# Altium schematic sheet Sheet3_mk.SchDoc
size 420 x 297 mm; Address1: Address1; Address2: Address2; Address3: Address3; Address4: Address4; SheetNumber: 1; Scale: 1:1; Обозначение документа: АБВГ.123456.001 Э3
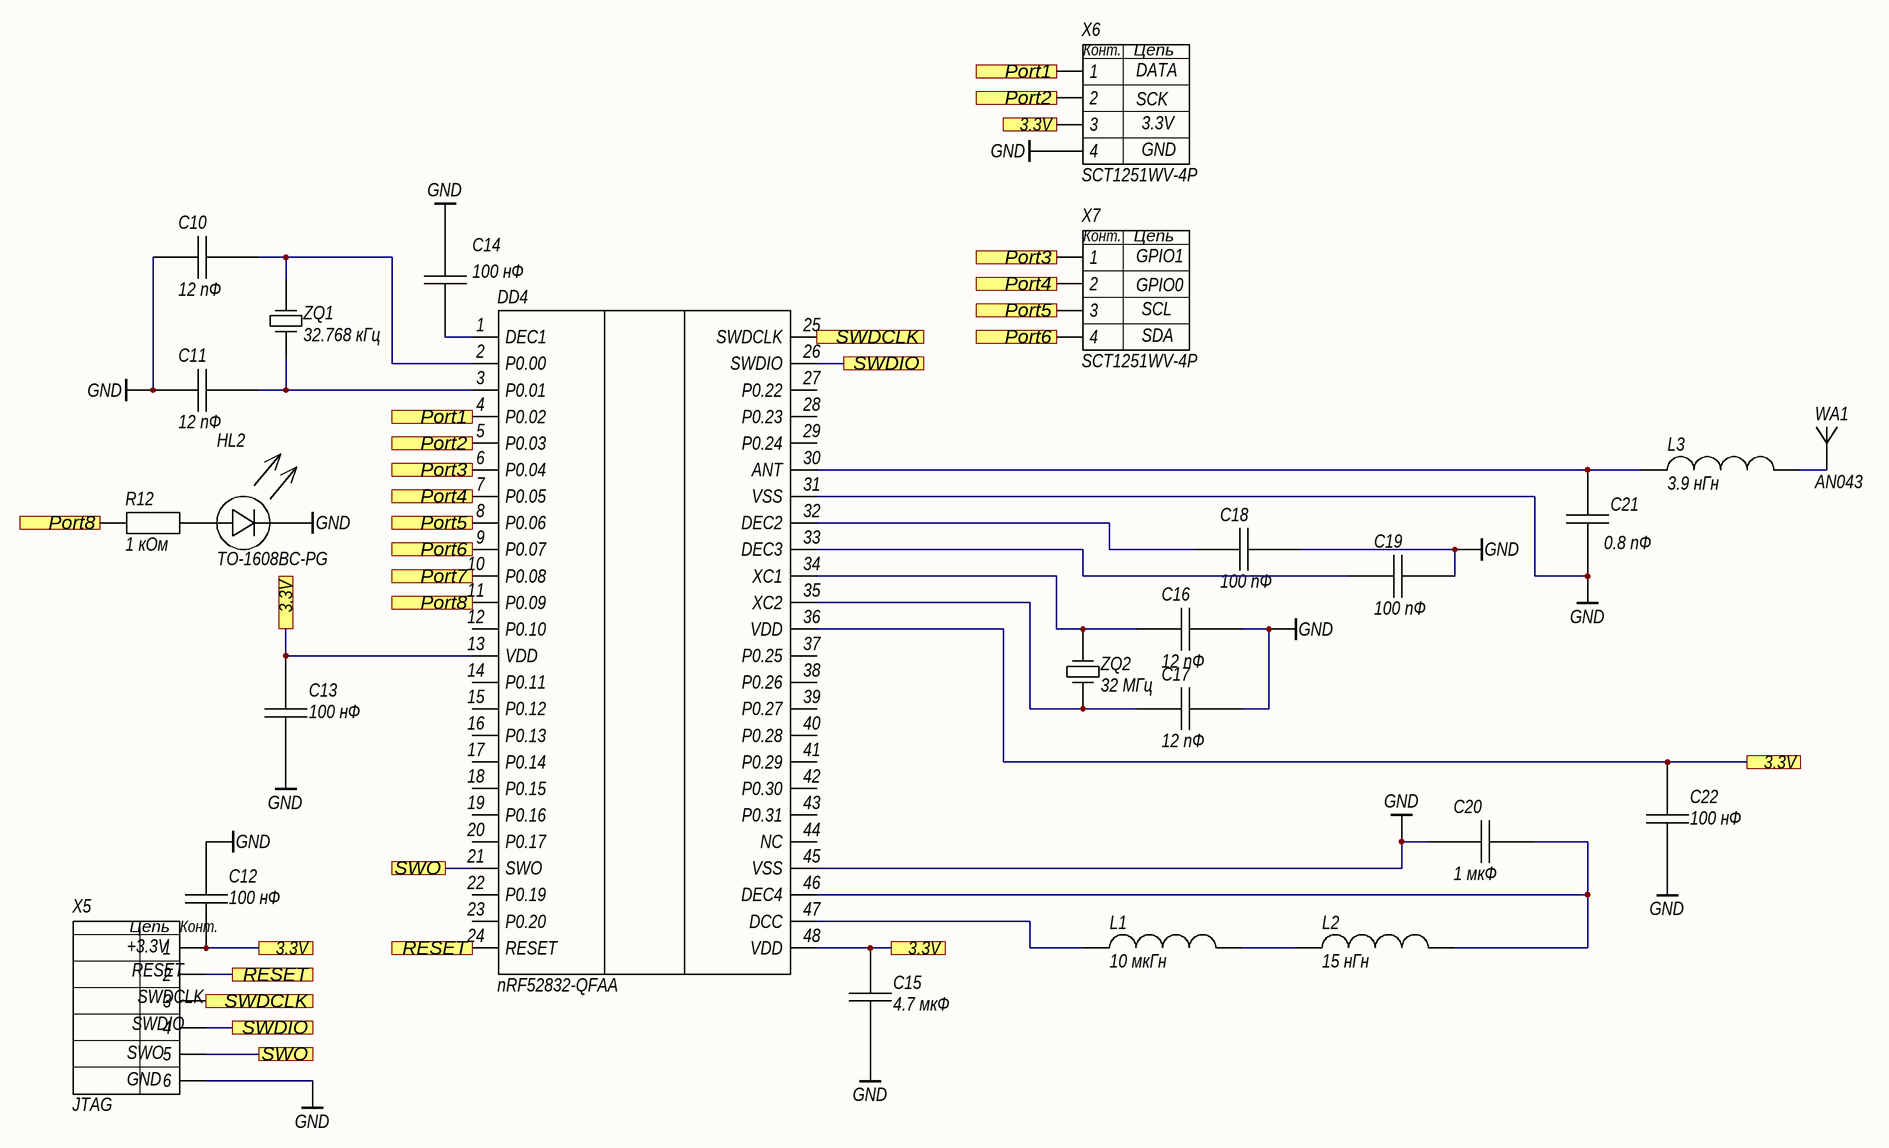
[diagram p0: Sheet3_mk.SchDoc]

## Parts
C10  12 пФ  [CAP_0805]
C11  12 пФ  [CAP_0805]
C12  100 нФ  [CAP_0805]
C13  100 нФ  [CAP_0805]
C14  100 нФ  [CAP_0805]
C15  4.7 мкФ  [CAP_0805]
C16  12 пФ  [CAP_0805]
C17  12 пФ  [CAP_0805]
C18  100 пФ  [CAP_0805]
C19  100 пФ  [CAP_0805]
C20  1 мкФ  [CAP_0805]
C21  0.8 пФ  [CAP_0805]
C22  100 нФ  [CAP_0805]
DD4  nRF52832-QFAA  [QFN48_6X6]
HL2  TO-1608BC-PG  [LED_0603]
L1  10 мкГн  [INDICT_0603]
L2  15 нГн  [INDICT_0402]
L3  3.9 нГн  [INDICT_0603]
R12  1 кОм  [RES_0603]
WA1  AN043  [BLE_50_Ohm_2400 MHz]
X5  JTAG  [RAZIEM_6_2.54mm]
X6  SCT1251WV-4P  [Raziem4(1)_1.25mm]
X7  SCT1251WV-4P  [Raziem4(1)_1.25mm]
ZQ1  32.768 кГц  [QUARTZ(32.768)]
ZQ2  32 МГц  [QUARTZ(32)]

## Ports
3.3V, Port1, Port2, Port3, Port4, Port5, Port6, Port7, Port8, RESET, SWDCLK, SWDIO, SWO

## Nets
GND: C10.1 C11.1 C12.2 C13.1 C14.1 C15.2 C16.2 C17.2 C18.2 C19.2 C20.2 C21.2 C22.1 DD4.31(VSS) DD4.45(VSS) HL2.K X5.6 X6.4
3.3V: C12.1 C13.2 C15.1 C22.2 DD4.13(VDD) DD4.36(VDD) DD4.48(VDD) X5.1 X6.3 ; port 3.3V
Port1: DD4.4(P0.02) X6.1 ; port Port1
Port2: DD4.5(P0.03) X6.2 ; port Port2
Port3: DD4.6(P0.04) X7.1 ; port Port3
Port4: DD4.7(P0.05) X7.2 ; port Port4
Port5: DD4.8(P0.06) X7.3 ; port Port5
Port6: DD4.9(P0.07) X7.4 ; port Port6
Port7: DD4.10(P0.08) ; port Port7
Port8: DD4.11(P0.09) R12.1 ; port Port8
RESET: DD4.24(RESET) X5.2 ; port RESET
SWDCLK: DD4.25(SWDCLK) X5.3 ; port SWDCLK
SWDIO: DD4.26(SWDIO) X5.4 ; port SWDIO
SWO: DD4.21(SWO) X5.5 ; port SWO
NetC10_2: C10.2 DD4.2(P0.00) ZQ1.2
NetC11_2: C11.2 DD4.3(P0.01) ZQ1.1
NetC14_2: C14.2 DD4.1(DEC1)
NetC16_1: C16.1 DD4.34(XC1) ZQ2.2
NetC17_1: C17.1 DD4.35(XC2) ZQ2.1
NetC18_1: C18.1 DD4.32(DEC2)
NetC19_1: C19.1 DD4.33(DEC3)
NetC20_1: C20.1 DD4.46(DEC4) L2.2
NetC21_1: C21.1 DD4.30(ANT) L3.1
NetDD4_47: DD4.47(DCC) L1.1
NetHL2_A: HL2.A R12.2
NetL1_2: L1.2 L2.1
NetL3_2: L3.2 WA1.1

Not connected (* = marked no-connect by the designer): DD4 12(P0.10) 14(P0.11) 15(P0.12) 16(P0.13) 17(P0.14) 18(P0.15) 19(P0.16) 20(P0.17) 22(P0.19) 23(P0.20) 27(P0.22) 28(P0.23) 29(P0.24) 37(P0.25) 38(P0.26) 39(P0.27) 40(P0.28) 41(P0.29) 42(P0.30) 43(P0.31) 44(NC)

## Notes on the sheet
- Подп. и дата
- Инв. № дубл.
- Взам. инв. №
- Инв. № подл.
- Изм.
- Лист
- № докум.
- Подп.
- Дата
- Копировал
- Формат А3
- (in symbol Raziem_4KONTKTA) Конт.; Цепь; GPIO1; GPIO0; SCL; SDA
- (in symbol Raziem_4KONTKTA_1) Конт.; Цепь; DATA; SCK; 3.3V; GND
- (in symbol Raziem_6KONTKT) Цепь; Конт.; +3.3V; RESET; SWDCLK; SWDIO; SWO; GND

## Library data of the parts
C10-C22 = Condensator
  C10 C11 C16 C17: Value: 12 пФ
  C12-C14 C22: Value: 100 нФ
  C15: Value: 4.7 мкФ
  C18 C19: Value: 100 пФ
  C20: Value: 1 мкФ
  C21: Value: 0.8 пФ
DD4 = Micro_Proc(nrf52832): Name: nRF52832-QFAA
HL2 = Svetodiode: Color: TO-1608BC-PG
L1-L3 = Induktivnost
  L1: Value: 10 мкГн
  L2: Value: 15 нГн
  L3: Value: 3.9 нГн
R12 = Rezistor: Value: 1 кОм
WA1 = Antena
X5 = Raziem_6KONTKT: Name: JTAG
X6 = Raziem_4KONTKTA_1: Name: SCT1251WV-4P
X7 = Raziem_4KONTKTA: Name: SCT1251WV-4P
ZQ1 ZQ2 = Kvarc_rezonator
  ZQ1: Name: 32.768 кГц
  ZQ2: Name: 32 МГц